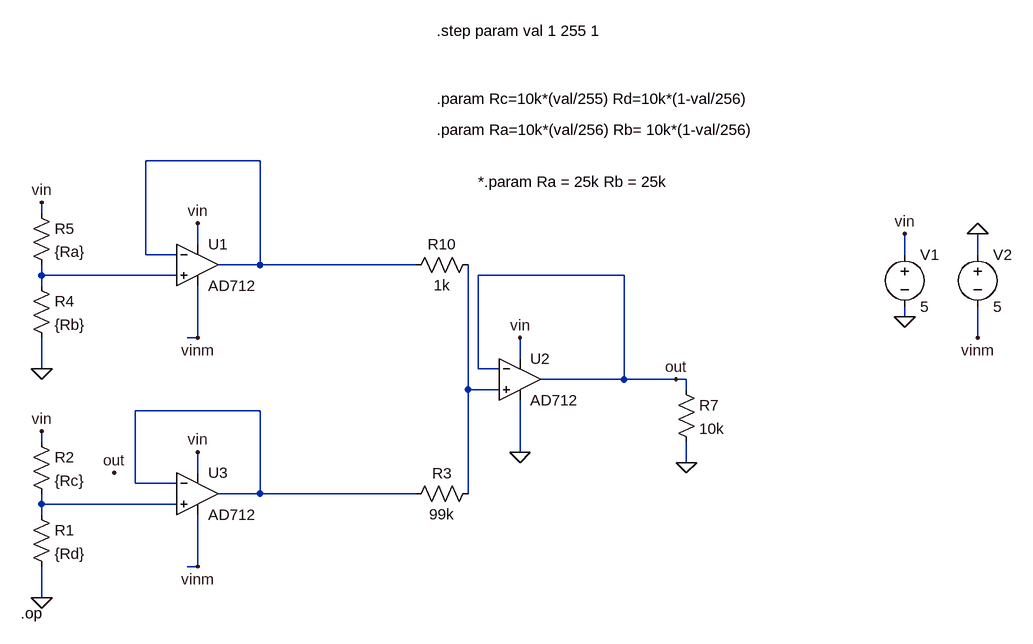
[diagram p0: schematic simulation_summing_amp.asc]
simulation_summing_amp.asc, the LTspice schematic file:
Version 4
SHEET 1 1384 680
WIRE 224 -480 48 -480
WIRE -112 -400 -112 -416
WIRE 128 -352 128 -384
WIRE 48 -336 48 -480
WIRE 96 -336 48 -336
WIRE 1216 -336 1216 -368
WIRE 1328 -336 1328 -368
WIRE 224 -320 224 -480
WIRE 224 -320 160 -320
WIRE 464 -320 224 -320
WIRE -112 -304 -112 -320
WIRE 96 -304 -112 -304
WIRE 784 -304 560 -304
WIRE -112 -288 -112 -304
WIRE 1216 -240 1216 -256
WIRE 128 -208 128 -288
WIRE 128 -208 112 -208
WIRE 1328 -208 1328 -256
WIRE 624 -176 624 -208
WIRE -112 -160 -112 -208
WIRE 560 -160 560 -304
WIRE 592 -160 560 -160
WIRE 784 -144 784 -304
WIRE 784 -144 656 -144
WIRE 864 -144 784 -144
WIRE 880 -144 864 -144
WIRE 544 -128 544 -320
WIRE 592 -128 544 -128
WIRE 880 -128 880 -144
WIRE 224 -96 32 -96
WIRE -112 -48 -112 -64
WIRE 624 -32 624 -112
WIRE 624 -32 608 -32
WIRE 880 -16 880 -48
WIRE 128 0 128 -32
WIRE 32 16 32 -96
WIRE 96 16 32 16
WIRE 224 32 224 -96
WIRE 224 32 160 32
WIRE 464 32 224 32
WIRE 544 32 544 -128
WIRE -112 48 -112 32
WIRE 96 48 -112 48
WIRE -112 64 -112 48
WIRE 128 144 128 64
WIRE 128 144 112 144
WIRE -112 192 -112 144
FLAG -112 192 0
FLAG -112 -160 0
FLAG -112 -416 vin
FLAG -112 -64 vin
FLAG 624 -208 vin
FLAG 880 -16 0
FLAG 1216 -240 0
FLAG 1216 -368 vin
FLAG 1328 -368 0
FLAG 1328 -208 vinm
FLAG 128 -384 vin
FLAG 128 -208 vinm
FLAG 128 -32 vin
FLAG 128 144 vinm
FLAG 624 -32 0
FLAG 864 -144 out
FLAG 0 0 out
SYMBOL res -128 48 R0
SYMATTR InstName R1
SYMATTR Value {Rd}
SYMBOL res -128 -64 R0
SYMATTR InstName R2
SYMATTR Value {Rc}
SYMBOL res 560 16 R90
WINDOW 0 0 56 VBottom 2
WINDOW 3 32 56 VTop 2
SYMATTR InstName R3
SYMATTR Value 99k
SYMBOL res -128 -304 R0
SYMATTR InstName R4
SYMATTR Value {Rb}
SYMBOL res -128 -416 R0
SYMATTR InstName R5
SYMATTR Value {Ra}
SYMBOL res 864 -144 R0
SYMATTR InstName R7
SYMATTR Value 10k
SYMBOL voltage 1216 -352 R0
WINDOW 123 0 0 Left 0
WINDOW 39 0 0 Left 0
SYMATTR InstName V1
SYMATTR Value 5
SYMBOL Opamps\\AD712 624 -208 R0
SYMATTR InstName U2
SYMBOL voltage 1328 -352 R0
WINDOW 123 0 0 Left 0
WINDOW 39 0 0 Left 0
SYMATTR InstName V2
SYMATTR Value 5
SYMBOL Opamps\\AD712 128 -384 R0
SYMATTR InstName U1
SYMBOL Opamps\\AD712 128 -32 R0
SYMATTR InstName U3
SYMBOL res 560 -336 R90
WINDOW 0 0 56 VBottom 2
WINDOW 3 32 56 VTop 2
SYMATTR InstName R10
SYMATTR Value 1k
TEXT 496 -528 Left 2 !.param Ra=10k*(val/256) Rb= 10k*(1-val/256)
TEXT 496 -576 Left 2 !.param Rc=10k*(val/255) Rd=10k*(1-val/256)
TEXT 496 -680 Left 2 !.step param val 1 255 1
TEXT -144 216 Left 2 !.op
TEXT 560 -448 Left 2 !*.param Ra = 25k Rb = 25k

The netlist it stands for:
* simulation_summing_amp.asc
R1 N005 0 {Rd}
R2 vin N005 {Rc}
R3 N003 N004 99k
R4 N002 0 {Rb}
R5 vin N002 {Ra}
R7 out 0 10k
V1 vin 0 5
XU2 N003 out vin 0 out AD712  ; pins In+ In- V+ V- OUT
V2 0 vinm 5
XU1 N002 N001 vin vinm N001 AD712  ; pins In+ In- V+ V- OUT
XU3 N005 N004 vin vinm N004 AD712  ; pins In+ In- V+ V- OUT
R10 N003 N001 1k
.param Ra=10k*(val/256) Rb= 10k*(1-val/256)
.param Rc=10k*(val/255) Rd=10k*(1-val/256)
.step param val 1 255 1
.op
*.param Ra = 25k Rb = 25k
.backanno
.end